# EAGLE design rip_base_2018 (EAGLE 7.7.0)
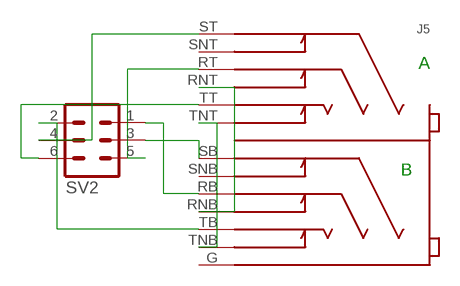
[diagram p0: schematic, sheet 1]

## Parts
J5  NSJ12HF  [NSJ12HF]
SV2  MA03-2  [MA03-2]

## Nets
N$1: J5.RB SV2.1
N$2: J5.TB SV2.2
N$3: J5.ST SV2.4
N$4: J5.RT SV2.5
N$5: J5.TT SV2.6
N$7: J5.TNB J5.TNT
N$9: J5.RNB J5.RNT
N$11: J5.SB SV2.3
Unconnected: J5.G J5.SNB J5.SNT

## Notes on the sheet
- A
- B

## Library data of the parts
J5 = monome-inc:NSJ12HF: double stack 1/4" TRS jack
SV2 = con-lstb:MA03-2: PIN HEADER; OC_FARNELL: unknown; OC_NEWARK: unknown

## Board
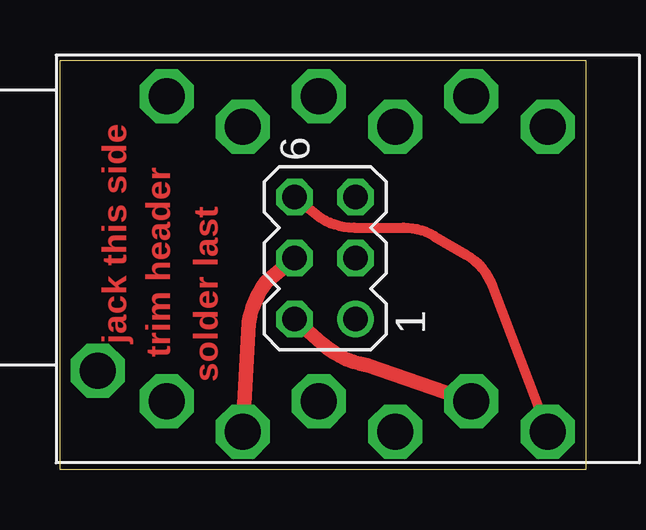
[diagram p1: board, top side]
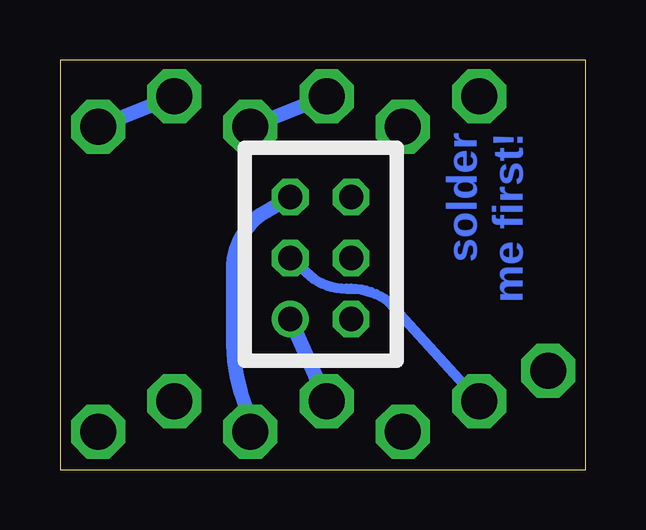
[diagram p2: board, bottom side, seen from below]

Size 21.91 x 17.07 mm. Coordinates in mm from the lower left corner, seen from the top.
Outline: 0,0 0,17.07 21.91,17.07 21.91,0 0,0
Copper layers (1*16): Top 0.035mm / dielectric 1.5mm / Bottom 0.035mm
Design rules "default *": minimum track width 8mil, minimum drill 15mil, track to track 8mil, track to pad 8mil, pad to pad 8mil, via to via 8mil, smd to smd 8mil, copper to edge 13mil, drill to drill 8mil, minimum pad ring 10mil, minimum via ring 8mil, stop-mask expansion 4mil, vias tented up to drill 0mil, thermal gap 8mil

### Footprints (pad centres in the part's own frame; a part is rotated, then mirrored left to right if it is on the bottom)
NSJ12HF = drill 1.5 octagon: G -1.73,5.96; RB -10.95,7.23; RNB -10.95,-5.47; RNT -14.13,-4.2; RT -14.13,8.5; SB -4.606,7.23; SNB -4.606,-5.47; SNT -7.78,-4.2; ST -7.78,8.5; TB -17.3,7.23; TNB -17.3,-5.47; TNT -20.48,-4.2; TT -20.48,8.5
MA03-2 = drill 1.016: 1 -2.54,-1.27 | drill 1.016 octagon: 2 -2.54,1.27; 3 0,-1.27; 4 0,1.27; 5 2.54,-1.27; 6 2.54,1.27

### Placement (x,y rotation side)
J5  -0.16,10.08 180 top
SV2  11.04,8.81 90 top

### Tracks (layer width: path | path; a pad name or v marks a point on that pad's centre or on a via)
N$1
  Bottom 0.61: J5.RB SV2.1
N$2
  Top 0.61: J5.TB 12.79,4.34 arc-31 10.93,5.24 SV2.2
N$3
  Top 0.61: J5.ST 7.87,6.12 arc-29 8.59,7.82 SV2.4
N$4
  Bottom 0.61: J5.RT 13.9,1.97 arc28 14.68,5.88 14.68,8.53 arc49 13.58,10.6 SV2.5
N$5
  Top 0.406: SV2.6 10.88,10.48 arc33 12.25,10.08 14.31,10.08 arc-30 15.6,9.73 16.93,8.95 arc-39 18.02,7.66 J5.TT
N$7
  Bottom 0.61: J5.TNB J5.TNT
N$9
  Bottom 0.61: J5.RNB J5.RNT
N$11
  Bottom 0.406: SV2.3 11.34,7.94 arc-33 9.97,7.54 9.79,7.54 arc39 8.19,6.97 J5.SB

### Text on the board
Top: jack this side | trim header | solder last
Bottom: solder / me first!
tStop: jack this side | trim header | solder last
bStop: solder / me first!